# Altium schematic sheet OPAMP_TESTER_2.SchDoc
size A4; SheetNumber: 3; SheetTotal: 4
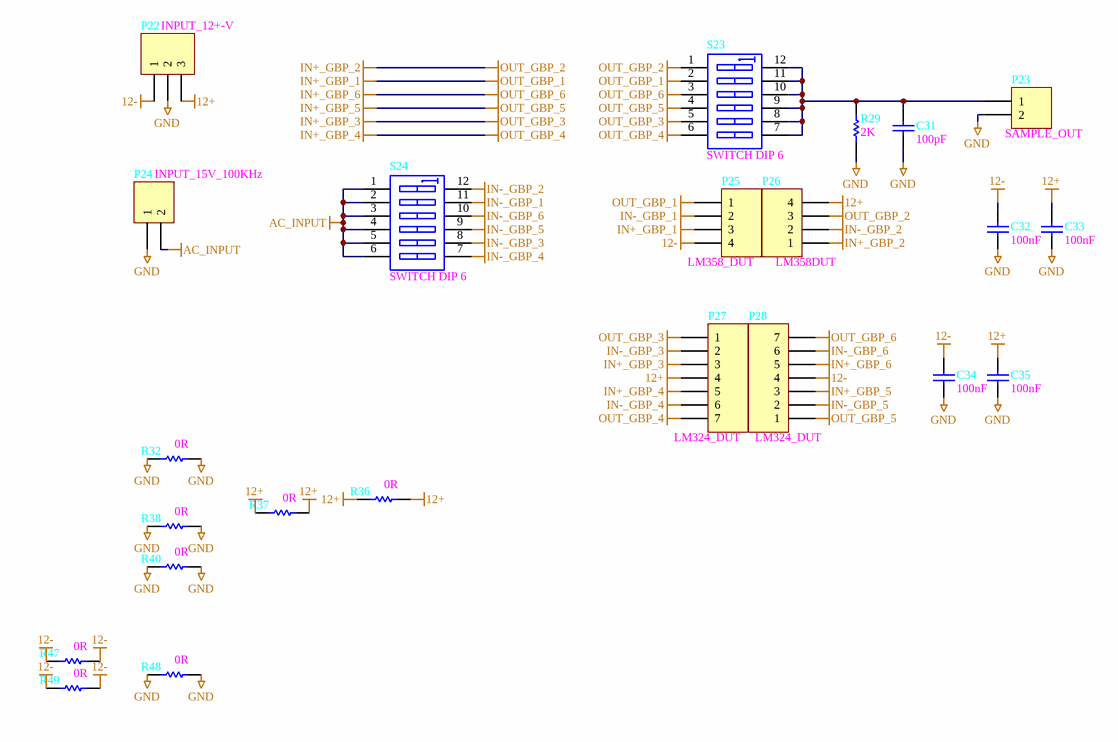
[diagram p0: OPAMP_TESTER_2.SchDoc]

## Parts
C31  100pF  [SMD 0805]
C32  100nF  [SMD 0805]
C33  100nF  [SMD 0805]
C34  100nF  [SMD 1206]
C35  100nF  [SMD 1206]
P22  INPUT_12+-V  [CON XH 3]
P23  SAMPLE_OUT  [CON XH 2]
P24  INPUT_15V_100KHz  [CON XH 2]
P25  LM358_DUT  [CON HDR 2.54FM 4]
P26  LM358DUT  [CON HDR 2.54FM 4]
P27  LM324_DUT  [CON HDR 2.54FM 7]
P28  LM324_DUT  [CON HDR 2.54FM 7]
R29  2K  [SMD 0805]
R32  0R  [SMD 1206]
R36  0R  [SMD 1206]
R37  0R  [SMD 1206]
R38  0R  [SMD 1206]
R40  0R  [SMD 1206]
R47  0R  [SMD 1206]
R48  0R  [SMD 1206]
R49  0R  [SMD 1206]
S23  SWITCH DIP 6  [SWITCH DIP 6]
S24  SWITCH DIP 6  [SWITCH DIP 6]

## Nets
12+: C33.2 C35.2 P22.3 P26.4 P27.4 R36.1 R36.2 R37.1 R37.2
12-: C32.2 C34.2 P22.1 P25.4 P28.4 R47.1 R47.2 R49.1 R49.2
AC_INPUT: P24.2 S24.1(A1) S24.2(A2) S24.3(A3) S24.4(A4) S24.5(A5) S24.6(A6)
GND: C31.1 C32.1 C33.1 C34.1 C35.1 P22.2 P23.2 P24.1 R29.2 R32.1 R32.2 R38.1 R38.2 R40.1 R40.2 R48.1 R48.2
IN+_GBP_1: P25.1 P25.3 S23.2(A2)  [also labelled OUT_GBP_1]
IN+_GBP_2: P26.1 P26.3 S23.1(A1)  [also labelled OUT_GBP_2]
IN+_GBP_3: P27.1 P27.3 S23.5(A5)  [also labelled OUT_GBP_3]
IN+_GBP_4: P27.5 P27.7 S23.6(A6)  [also labelled OUT_GBP_4]
IN+_GBP_5: P28.1 P28.3 S23.4(A4)  [also labelled OUT_GBP_5]
IN+_GBP_6: P28.5 P28.7 S23.3(A3)  [also labelled OUT_GBP_6]
IN-_GBP_1: P25.2 S24.11(B2)
IN-_GBP_2: P26.2 S24.12(B1)
IN-_GBP_3: P27.2 S24.8(B5)
IN-_GBP_4: P27.6 S24.7(B6)
IN-_GBP_5: P28.2 S24.9(B4)
IN-_GBP_6: P28.6 S24.10(B3)
NetC31_2: C31.2 P23.1 R29.1 S23.7(B6) S23.8(B5) S23.9(B4) S23.10(B3) S23.11(B2) S23.12(B1)

## Notes on the sheet
- DrawnBy:
- ProjectName:
- Date:
- CheckedBy:
- Size:
- A4
- File:
- Sheet
- of

## Library data of the parts
C31-C35 = CAP: Capacitor; Published: 8-Jun-2000; LatestRevisionDate: 17-Jul-2002; LatestRevisionNote: Re-released for DXP Platform.; PackageReference: RAD-0.3; Publisher: Altium Limited; PackageDescription: Radial Cap, Thru-Hole; 2 Leads; 0.3 in Pin Spacing
P22 = CONNECTOR 3: Header, 3-Pin; LatestRevisionDate: 17-Jul-2002; LatestRevisionNote: Re-released for DXP Platform.; Publisher: Altium Limited
P23 P24 = CONNECTOR 2: Header, 2-Pin; LatestRevisionDate: 17-Jul-2002; LatestRevisionNote: Re-released for DXP Platform.; Publisher: Altium Limited
P25 P26 = CONNECTOR 4: Header, 4-Pin; LatestRevisionDate: 17-Jul-2002; LatestRevisionNote: Re-released for DXP Platform.; Publisher: Altium Limited
P27 P28 = CONNECTOR 7: Header, 7-Pin; LatestRevisionDate: 17-Jul-2002; LatestRevisionNote: Re-released for DXP Platform.; Publisher: Altium Limited
R29 R32 R36-R38 R40 R47-R49 = RES: Resistor
S23 S24 = SWITCH DIP 6: DIP Switch, 6 Position, SPST; Published: 24-Mar-1999; LatestRevisionDate: 17-Jul-2002; LatestRevisionNote: Re-released for DXP Platform.; PackageReference: DIP-12/SW; Publisher: Altium Limited; PackageDescription: DIP Switch; 12 Leads